# Altium schematic sheet 02_power.SchDoc: SENSEI Sensor Shield - Power
size A4; Author: Philip Wiese; DrawnBy: Philip Wiese; Engineer: Philip Wiese; Organization: Integrated System Laboratory; DocumentNumber: 2; Revision: v1.0; SheetNumber: 2; SheetTotal: 4
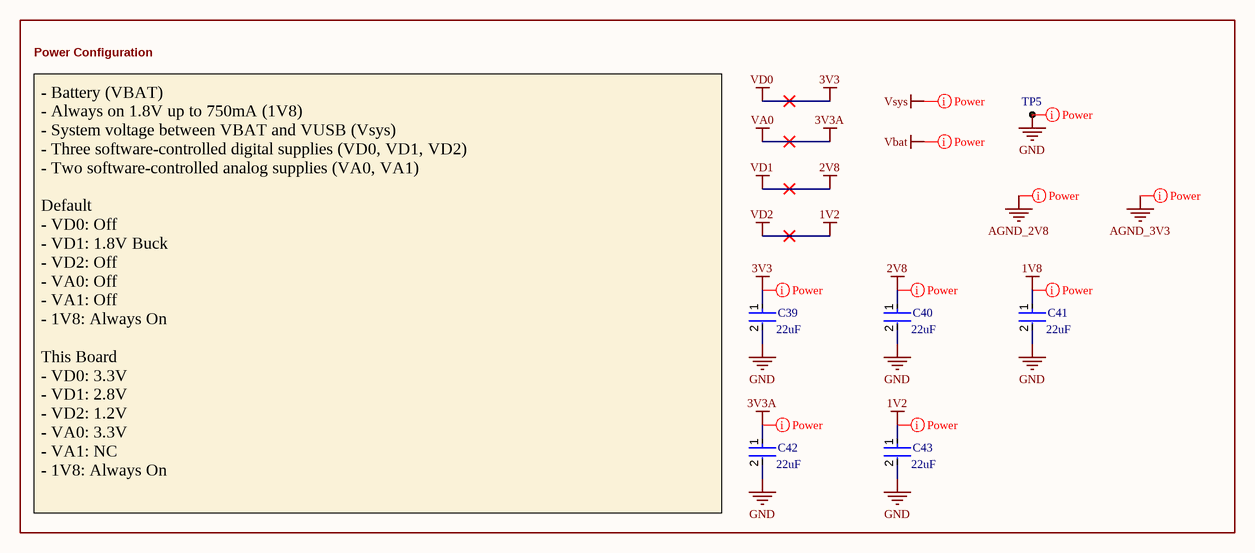
[diagram p0: 02_power.SchDoc]

## Parts
C39  Capacitance: 22uF  [FP-GRM158-0_2-IPC_A]  (hidden comment: GRM158R60J226ME01D)
C40  Capacitance: 22uF  [FP-GRM158-0_2-IPC_A]  (hidden comment: GRM158R60J226ME01D)
C41  Capacitance: 22uF  [FP-GRM158-0_2-IPC_A]  (hidden comment: GRM158R60J226ME01D)
C42  Capacitance: 22uF  [FP-GRM158-0_2-IPC_A]  (hidden comment: GRM158R60J226ME01D)
C43  Capacitance: 22uF  [FP-GRM158-0_2-IPC_A]  (hidden comment: GRM158R60J226ME01D)
TP5  Test Pad  [Pad-0.6mm]  (value not drawn)  (no BOM)

## Blocks framed on the sheet
Power Configuration: C39-C43 TP5

## Nets
1V2: C43.1  [also labelled VD2]
1V8: C41.1
2V8: C40.1  [also labelled VD1]
3V3: C39.1  [also labelled VD0]
3V3A: C42.1  [also labelled VA0]
GND: C39.2 C40.2 C41.2 C42.2 C43.2 TP5.1

## Layout directives
net class Power: 1V2, 1V8, 2V8, 3V3, 3V3A, AGND_2V8, AGND_3V3, GND, Vbat, Vsys

## Notes on the sheet
- - Battery (VBAT)
  - Always on 1.8V up to 750mA (1V8)
  - System voltage between VBAT and VUSB (Vsys)
  - Three software-controlled digital supplies (VD0, VD1, VD2)
  - Two software-controlled analog supplies (VA0, VA1)
  Default
  - VD0: Off
  - VD1: 1.8V Buck
  - VD2: Off
  - VA0: Off
  - VA1: Off
  - 1V8: Always On
  This Board
  - VD0: 3.3V
  - VD1: 2.8V
  - VD2: 1.2V
  - VA0: 3.3V
  - VA1: NC
  - 1V8: Always On
- Labels drawn without touching a wire or pin: AGND_2V8, AGND_3V3, Vbat, Vsys
- 1
- 2
- 3
- 4
- A
- B
- C
- Project:
- D
- Date:
- Drawing number:
- Rev:
- Format:
- A4 Q
- Drawn by:
- Laboratory:
- Page
- Sheet:
- of
- File:

## Library data of the parts
C39-C43 = CMP-06035-062950-1: CAP CER 22UF 6.3V X5R 0402; Manufacturer: Murata; Tolerance: 20%; Supplier 1: Mouser; Supplier Part Number 1: 81-GRM158R60J226ME1D; Manufacturer Part Number: GRM158R60J226ME01D; RoHS: Yes; Category: Ceramic Capacitors; Stock 1: 319406; Pricing 1: 1=0.4, 10=0.2, 50=0.2, 100=0.129, 1000=0.107, 10000=0.089 (USD)
TP5 = CMP-00224-2: 0.6mm SMT Test Pad; Mounting Technology: SMT